# Altium project YVision Ground.PrjPcb
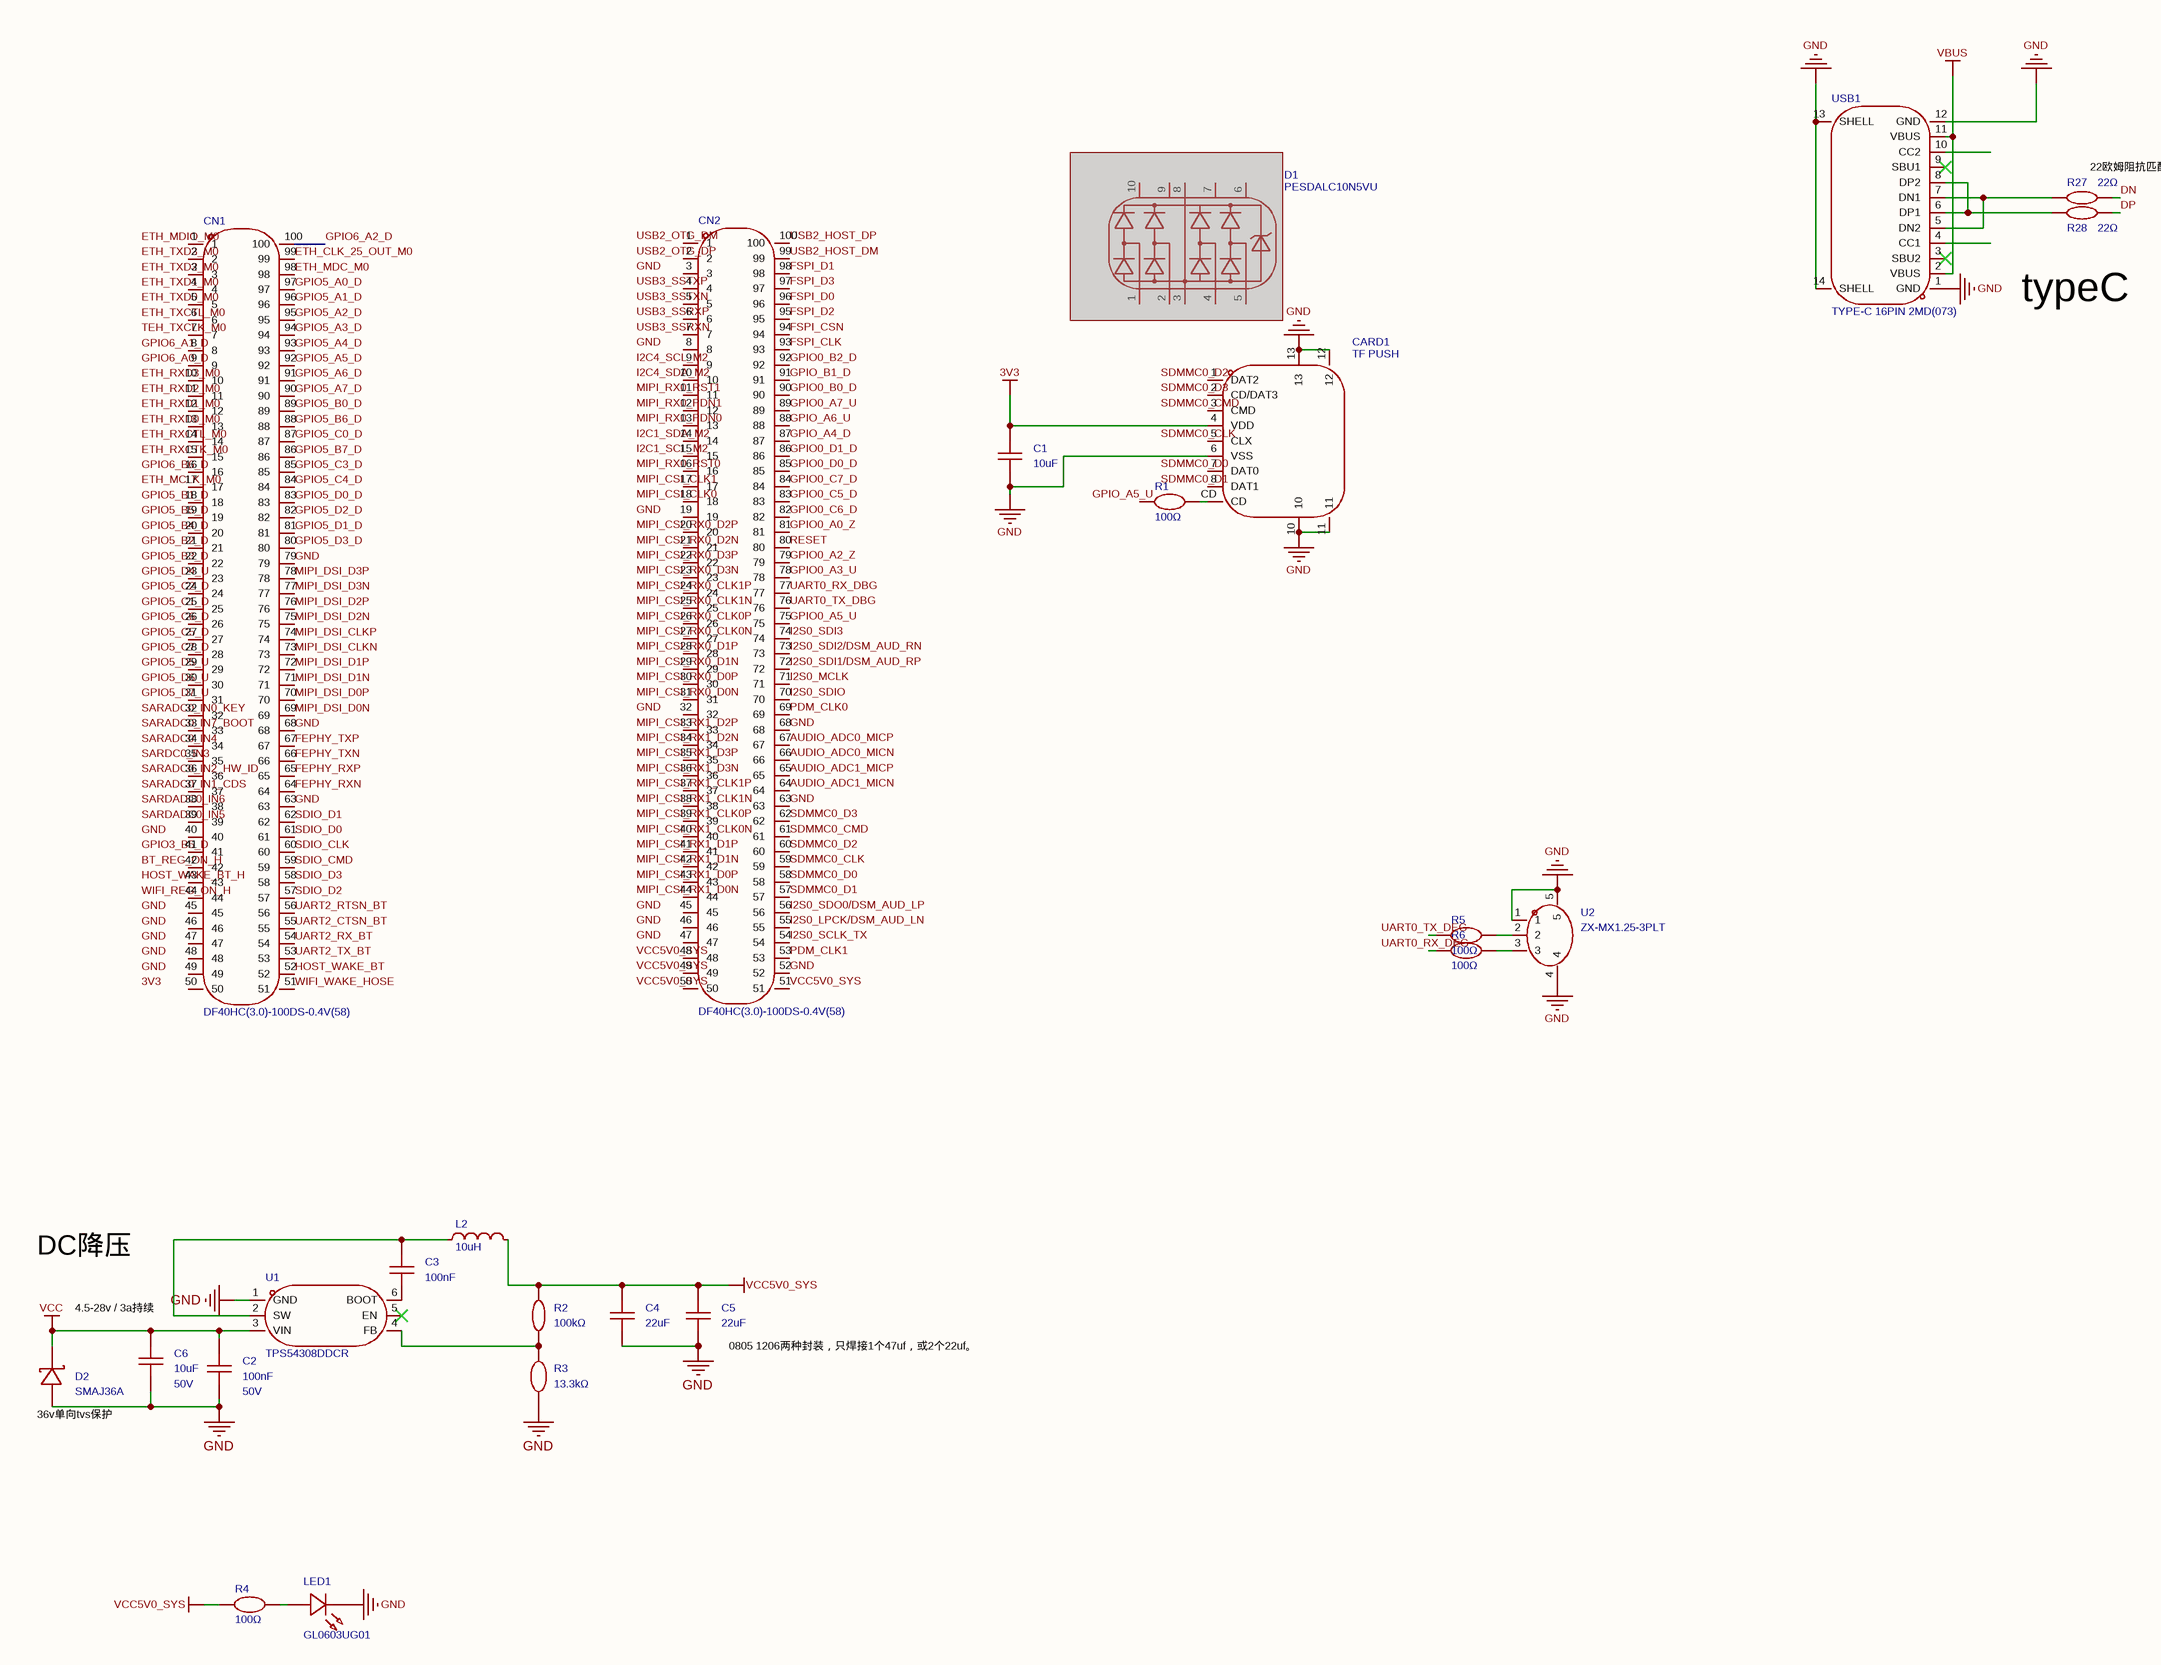
[diagram p0: Schematic1P1.schdoc]
1 sheet, 24 parts. Net scope: global (net labels, ports and power ports of the same name join across sheets).
Board file: PCB.PcbDoc

## Sheet Schematic1P1.schdoc
size 420 x 297 mm; Symbol: Drawing-Symbol_A4; Company: 嘉立创EDA; Version: V1.0; Page Size: A4; @Project Name: YVision_AIR; @Update Date: 2026-09-13; @Create Date: 2026-09-13; Device: Drawing-Symbol_A4; @Board Name: Board1; @Page Name: P1; @Create Time: 01:14:27; @Page Count: 1; @Page No: 1; @Schematic Name: Schematic1; @Update Time: 01:14:27; @Assembly Variant: Basic; Border: 1; Title Block Position: 3; Size: A4; Width: 1655; Height: 1170; Region Start: 1; X Region Count: 6; Y Region Count: 4; Blade Width: 10; SheetNumber: 1; SheetTotal: 1

### Parts
C1  10uF  [C0603]
C2  100nF  Voltage Rated: 50V  [C0603_S]
C3  100nF  [C0603_S]
C4  22uF  [C0805]
C5  22uF  [C0805]
C6  10uF  Voltage Rated: 50V  [C0805_S]
CARD1  TF PUSH  [TF-SMD_TF-PUSH]
CN1  DF40HC(3.0)-100DS-0.4V(58)  [CONN-SMD_DF40HC-3.0-100DS-0.4V-51]
CN2  DF40HC(3.0)-100DS-0.4V(58)  [CONN-SMD_DF40HC-3.0-100DS-0.4V-51]
D1  PESDALC10N5VU  [DFN2510-10_L2.5-W1.0-P0.50-BL]  (masked out: inside a compile mask, not in the netlist)
D2  SMAJ36A  [SMA_L4.3-W2.6-LS5.2-RD]
L2  10uH  [IND-SMD_L4.0-W4.0]
LED1  GL0603UG01  [LED0603-RD]
R1  100Ω  [R0603]
R2  100kΩ  [R0603_S]
R3  13.3kΩ  [R0603_S]
R4  100Ω  [R0402]
R5  100Ω  [R0603]
R6  100Ω  [R0603]
R27  22Ω  [R0603]
R28  22Ω  [R0603]
U1  TPS54308DDCR  [SOT-23-6_L2.9-W1.6-P0.95-LS2.8-BR]
U2  ZX-MX1.25-3PLT  [CONN-SMD_3P-P1.25_MEGASTAR_ZX-MX1.25-3PLT]
USB1  TYPE-C 16PIN 2MD(073)  [USB-C-SMD_TYPE-C-6PIN-2MD-073]

### Nets
3V3: C1.2 CARD1.4(VDD)
GND: C1.1 C2.1 C4.1 C5.1 C6.1 CARD1.6(VSS) CARD1.10 CARD1.11 CARD1.12 CARD1.13 CN1.63 CN1.68 CN1.79 CN2.52 CN2.63 CN2.68 D2.2(A) LED1.1(K) R3.1 U1.1(GND) U2.1 U2.4 U2.5 USB1.1(GND) USB1.12(GND) USB1.13(SHELL) USB1.14(SHELL)
VBUS: USB1.2(VBUS) USB1.11(VBUS)
VCC: C2.2 C6.2 D2.1(K) U1.3(VIN)
VCC5V0_SYS: C4.2 C5.2 CN2.51 L2.2 R2.2 R4.1
AUDIO_ADC0_MICN: CN2.66
AUDIO_ADC0_MICP: CN2.67
AUDIO_ADC1_MICN: CN2.64
AUDIO_ADC1_MICP: CN2.65
DN: R27.2
DP: R28.2
ETH_CLK_25_OUT_M0: CN1.99
ETH_MDC_M0: CN1.98
FEPHY_RXN: CN1.64
FEPHY_RXP: CN1.65
FEPHY_TXN: CN1.66
FEPHY_TXP: CN1.67
FSPI_CLK: CN2.93
FSPI_CSN: CN2.94
FSPI_D0: CN2.96
FSPI_D1: CN2.98
FSPI_D2: CN2.95
FSPI_D3: CN2.97
GPIO0_A0_Z: CN2.81
GPIO0_A2_Z: CN2.79
GPIO0_A3_U: CN2.78
GPIO0_A5_U: CN2.75
GPIO0_A7_U: CN2.89
GPIO0_B0_D: CN2.90
GPIO0_B2_D: CN2.92
GPIO0_C5_D: CN2.83
GPIO0_C6_D: CN2.82
GPIO0_C7_D: CN2.84
GPIO0_D0_D: CN2.85
GPIO0_D1_D: CN2.86
GPIO5_A0_D: CN1.97
GPIO5_A1_D: CN1.96
GPIO5_A2_D: CN1.95
GPIO5_A3_D: CN1.94
GPIO5_A4_D: CN1.93
GPIO5_A5_D: CN1.92
GPIO5_A6_D: CN1.91
GPIO5_A7_D: CN1.90
GPIO5_B0_D: CN1.89
GPIO5_B6_D: CN1.88
GPIO5_B7_D: CN1.86
GPIO5_C0_D: CN1.87
GPIO5_C3_D: CN1.85
GPIO5_C4_D: CN1.84
GPIO5_D0_D: CN1.83
GPIO5_D1_D: CN1.81
GPIO5_D2_D: CN1.82
GPIO5_D3_D: CN1.80
GPIO6_A2_D: CN1.100
GPIO_A4_D: CN2.87
GPIO_A6_U: CN2.88
GPIO_B1_D: CN2.91
HOST_WAKE_BT: CN1.52
I2S0_LPCK/DSM_AUD_LN: CN2.55
I2S0_MCLK: CN2.71
I2S0_SCLK_TX: CN2.54
I2S0_SDI1/DSM_AUD_RP: CN2.72
I2S0_SDI2/DSM_AUD_RN: CN2.73
I2S0_SDI3: CN2.74
I2S0_SDIO: CN2.70
I2S0_SDO0/DSM_AUD_LP: CN2.56
MIPI_DSI_CLKN: CN1.73
MIPI_DSI_CLKP: CN1.74
MIPI_DSI_D0N: CN1.69
MIPI_DSI_D0P: CN1.70
MIPI_DSI_D1N: CN1.71
MIPI_DSI_D1P: CN1.72
MIPI_DSI_D2N: CN1.75
MIPI_DSI_D2P: CN1.76
MIPI_DSI_D3N: CN1.77
MIPI_DSI_D3P: CN1.78
PDM_CLK0: CN2.69
PDM_CLK1: CN2.53
RESET: CN2.80
SDIO_CLK: CN1.60
SDIO_CMD: CN1.59
SDIO_D0: CN1.61
SDIO_D1: CN1.62
SDIO_D2: CN1.57
SDIO_D3: CN1.58
SDMMC0_CLK: CN2.59
SDMMC0_CMD: CN2.61
SDMMC0_D0: CN2.58
SDMMC0_D1: CN2.57
SDMMC0_D2: CN2.60
SDMMC0_D3: CN2.62
UART0_RX_DBG: CN2.77
UART0_TX_DBG: CN2.76
UART2_CTSN_BT: CN1.55
UART2_RTSN_BT: CN1.56
UART2_RX_BT: CN1.54
UART2_TX_BT: CN1.53
USB2_HOST_DM: CN2.99
USB2_HOST_DP: CN2.100
WIFI_WAKE_HOSE: CN1.51
NetC3_1: C3.1 U1.6(BOOT)
NetC3_2: C3.2 L2.1 U1.2(SW)
NetCARD1_CD: CARD1.CD R1.2
NetLED1_2: LED1.2(A) R4.2
NetR2_1: R2.1 R3.2 U1.4(FB)
NetR5_2: R5.2 U2.2
NetR6_2: R6.2 U2.3
NetR27_1: R27.1 USB1.5(DN2) USB1.7(DN1)
NetR28_1: R28.1 USB1.6(DP1) USB1.8(DP2)

Not connected (* = marked no-connect by the designer): CARD1 1(DAT2) 2(CD/DAT3) 3(CMD) 5(CLX) 7(DAT0) 8(DAT1); CN1 1 2 3 4 5 6 7 8 9 10 11 12 13 14 15 16 17 18 19 20 21 22 23 24 25 26 27 28 29 30 31 32 33 34 35 36 37 38 39 40 41 42 43 44 45 46 47 48 49 50; CN2 1 2 3 4 5 6 7 8 9 10 11 12 13 14 15 16 17 18 19 20 21 22 23 24 25 26 27 28 29 30 31 32 33 34 35 36 37 38 39 40 41 42 43 44 45 46 47 48 49 50; R1 1; R5 1; R6 1; U1 5(EN)*; USB1 3(SBU2)* 4(CC1) 9(SBU1)* 10(CC2)

### Notes on the sheet
- 22欧姆阻抗匹配
- typeC
- DC降压
- (near C6) 4.5-28v / 3a持续
- (near C5) 0805 1206两种封装，只焊接1个47uf，或2个22uf。
- (near D2) 36v单向tvs保护
- Labels drawn without touching a wire or pin: 3V3, BT_REG_ON_H, ETH_MCLK_M0, ETH_MDIO_M0, ETH_RXCTK_M0, ETH_RXCTL_M0, ETH_RXD0_M0, ETH_RXD1_M0, ETH_RXD2_M0, ETH_RXD3_M0, ETH_TXCTL_M0, ETH_TXD0_M0, ETH_TXD1_M0, ETH_TXD2_M0, ETH_TXD3_M0, GND, GPIO3_B5_D, GPIO5_B1_D, GPIO5_B2_D, GPIO5_B3_D, GPIO5_B4_D, GPIO5_B5_D, GPIO5_C1_D, GPIO5_C2_D, GPIO5_C5_D, GPIO5_C6_D, GPIO5_C7_D, GPIO5_D4_U, GPIO5_D5_U, GPIO5_D6_U, GPIO5_D7_U, GPIO6_A0_D, GPIO6_A1_D, GPIO6_B6_D, GPIO_A5_U, HOST_WAKE_BT_H, I2C1_SCL_M2, I2C1_SDA_M2, I2C4_SCL_M2, I2C4_SDA_M2, MIPI_CSI_CLK0, MIPI_CSI_CLK1, MIPI_CSI_RX0_CLK0N, MIPI_CSI_RX0_CLK0P, MIPI_CSI_RX0_CLK1N, MIPI_CSI_RX0_CLK1P, MIPI_CSI_RX0_D0N, MIPI_CSI_RX0_D0P, MIPI_CSI_RX0_D1N, MIPI_CSI_RX0_D1P, MIPI_CSI_RX0_D2N, MIPI_CSI_RX0_D2P, MIPI_CSI_RX0_D3N, MIPI_CSI_RX0_D3P, MIPI_CSI_RX1_CLK0N, MIPI_CSI_RX1_CLK0P, MIPI_CSI_RX1_CLK1N, MIPI_CSI_RX1_CLK1P, MIPI_CSI_RX1_D0N, MIPI_CSI_RX1_D0P, MIPI_CSI_RX1_D1N, MIPI_CSI_RX1_D1P, MIPI_CSI_RX1_D2N, MIPI_CSI_RX1_D2P, MIPI_CSI_RX1_D3N, MIPI_CSI_RX1_D3P, MIPI_RX0_PDN0, MIPI_RX0_PDN1, MIPI_RX0_RST0, MIPI_RX0_RST1, SARADC0_IN0_KEY, SARADC0_IN1_CDS, SARADC0_IN2_HW_ID, SARADC0_IN4, SARADC0_IN7_BOOT, SARDADC0_IN5, SARDADC0_IN6, SARDC0_IN3, SDMMC0_CLK, SDMMC0_CMD, SDMMC0_D0, SDMMC0_D1, SDMMC0_D2, SDMMC0_D3, TEH_TXCLK_M0, UART0_RX_DEG, UART0_TX_DEG, USB2_OTG_DM, USB2_OTG_DP, USB3_SSRXN, USB3_SSRXP, USB3_SSTXN, USB3_SSTXP, VCC5V0_SYS, WIFI_REG_ON_H

### Library data of the parts
C1 = FCC0603X106K100CT: 容值:10uF;精度:±10%;额定电压:10V;温度系数:X5R;; Manufacturer: FOJAN(富捷); AddInBom: yes; ModelId: ac125912035d415993ca9572d50418b1聨0819f05c4eef4c71ace90d822a990e87; ModelName: C0603_L1.6-W0.8-H0.8; ModelTransform: 62.992,31.496,0,0,0,0,0,0,0; Tolerance: ±10%; Voltage Rating: 10V; Temperature Coefficient: X5R; Symbol: FCC0603X106K100CT; Device: FCC0603X106K100CT; LCSC Part Name: 10uF ±10% 10V; SupplierPart: C5137565; ManufacturerPart: FCC0603X106K100CT; Supplier Footprint: 0603; JLCPCB Part Class: Extended Part; Datasheet: https://item.szlcsc.com/datasheet/FCC0603X106K100CT/5747017.html; Supplier: LCSC; ConvertToPcb: yes; FootprintName: C0603; Value: 10uF; Operating Temperature: -55℃~+85℃
C2 = CC0603KRX7R9BB104: 容值:100nF;精度:±10%;额定电压:50V;材质(温度系数):X7R;; Manufacturer: YAGEO(国巨); Convert to PCB: yes; 3D Model: ac125912035d415993ca9572d50418b1; 3D Model Transform: 62.992,31.496,0,0,0,0,0,0,0; Tolerance: ±10%; Temperature Coefficient: X7R; ModelName: C0603_L1.6-W0.8-H0.8; Symbol: CC0603KRX7R9BB104; Device: CC0603KRX7R9BB104; LCSC Part Name: 100nF ±10% 50V; Supplier Footprint: 0603; Datasheet: https://atta.szlcsc.com/upload/public/pdf/source/20180910/C282072_33301C7F631E79921B82A8DAC6BCC5B3.pdf; Supplier: LCSC; Manufacturer Part: CC0603KRX7R9BB104; Value: 100nF; Supplier Part: C14663; JLCPCB Part Class: 基础库; AddInBom: yes; FootprintName: C0603_S
C3 = CC0603KRX7R9BB104: 容值:100nF;精度:±10%;额定电压:50V;材质(温度系数):X7R;; Manufacturer: YAGEO(国巨); 3D Model: ac125912035d415993ca9572d50418b1; 3D Model Transform: 62.992,31.496,0,0,0,0,0,0,0; Tolerance: ±10%; Voltage Rated: 50V; Temperature Coefficient: X7R; AddInBom: yes; ModelName: C0603_L1.6-W0.8-H0.8; Symbol: CC0603KRX7R9BB104; Device: CC0603KRX7R9BB104; LCSC Part Name: 100nF ±10% 50V; Supplier Footprint: 0603; Datasheet: https://atta.szlcsc.com/upload/public/pdf/source/20180910/C282072_33301C7F631E79921B82A8DAC6BCC5B3.pdf; Supplier: LCSC; Manufacturer Part: CC0603KRX7R9BB104; Value: 100nF; Supplier Part: C14663; JLCPCB Part Class: 基础库; ConvertToPcb: yes; FootprintName: C0603_S
C4 C5 = HGC0805R5226M350NSLJ: 容值:22uF;精度:±20%;额定电压:35V;温度系数:X5R;; Manufacturer: Chinocera(华瓷); 3D Model: 1ba041120af144c991958decab20d241聨0819f05c4eef4c71ace90d822a990e87; 3D Model Transform: 78.74,51.181,0,0,0,0,0,0.0005,0; Tolerance: ±20%; Voltage Rating: 35V; Temperature Coefficient: X5R; AddInBom: yes; ModelName: C0805_L2.0-W1.3-H1.3; Symbol: HGC0805R5226M350NSLJ; Device: HGC0805R5226M350NSLJ; LCSC Part Name: 22uF ±20% 35V; Supplier Part: C22367832; Manufacturer Part: HGC0805R5226M350NSLJ; Supplier Footprint: 0805; JLCPCB Part Class: Extended Part; Datasheet: https://item.szlcsc.com/datasheet/HGC0805R5226M350NSLJ/23841137.html; Supplier: LCSC; Value: 22uF; ConvertToPcb: yes; FootprintName: C0805
C6 = GRM21BR61H106KE43L: 容值:10uF;精度:±10%;额定电压:50V;材质(温度系数):X5R;; Manufacturer: muRata(村田); 3D Model: 1ba041120af144c991958decab20d241; 3D Model Transform: 78.74,51.181,0,0,0,0,0,0.0005,0; Tolerance: ±10%; Temperature Coefficient: X5R; AddInBom: yes; ModelName: C0805_L2.0-W1.3-H1.3; Symbol: GRM21BR61H106KE43L; Device: GRM21BR61H106KE43L; LCSC Part Name: 10uF ±10% 50V; Supplier Footprint: 0805; Datasheet: https://atta.szlcsc.com/upload/public/pdf/source/20230811/95AAE0C9AF55EDC31B7A4D8B733F534E.pdf; Supplier: LCSC; Supplier Part: C440198; Manufacturer Part: GRM21BR61H106KE43L; Value: 10uF; JLCPCB Part Class: 基础库; ConvertToPcb: yes; FootprintName: C0805_S
CARD1 = TF PUSH: 卡连接方式:自弹式;卡类型:MicroSD卡(TF卡);连接器类型:卡座;本体最大高度:2mm;工作温度:-25℃~+85℃;; Manufacturer: SHOU HAN(首韩); AddInBom: yes; ModelId: 2d6270e77c9a43c6bb0aca962ba811a2聨0819f05c4eef4c71ace90d822a990e87; ModelTransform: 635.826,598.424,0,0,0,0,0.002,-82.441,-23.622; Card Connection Mode: 自弹式; Connector Type: 卡座; Additional Card Detection Pins: 有; Symbol: TF PUSH; Device: TF PUSH; LCSC Part Name: 自弹式 MicroSD卡(TF卡) 卡座; SupplierPart: C393941; ManufacturerPart: TF PUSH; Supplier Footprint: SMD; JLCPCB Part Class: Extended Part; Datasheet: https://item.szlcsc.com/datasheet/TF%2520PUSH/372553.html; Supplier: LCSC; ConvertToPcb: yes; FootprintName: TF-SMD_TF-PUSH; ModelName: TF-SMD_TF-PUSH; Card Type: MicroSD卡(TF卡); Supplementary Features: -; Height Above Board: 2mm; Operating Temperature: -25℃~+85℃; Rated Voltage (Max): -; Length: 14.75mm; Width: 14.5mm
CN1 = DF40HC(3.0)-100DS-0.4V(58): 3D Model: 6a7bb5672138401ca803df45e026c3f5聨0819f05c4eef4c71ace90d822a990e87; 3D Model Transform: 889.762,133.0706,0,0,0,0,0,0,0; AddInBom: yes; Symbol: DF40HC(3.0)-100DS-0.4V(58); Device: DF40HC(3.0)-100DS-0.4V(58); LCSC Part Name: DF40HC(3.0)-100DS-0.4V(58); Supplier Part: C9900007647; Manufacturer Part: DF40HC(3.0)-100DS-0.4V(58); Supplier Footprint: CONN-SMD; JLCPCB Part Class: Extended Part; Supplier: LCSC; ConvertToPcb: yes; FootprintName: CONN-SMD_DF40HC-3.0-100DS-0.4V-51; ModelName: CONN-SMD_DF40HC-3.0-100DS-0.4V-51
CN2 = DF40HC(3.0)-100DS-0.4V(58): AddInBom: yes; ModelId: 6a7bb5672138401ca803df45e026c3f5聨0819f05c4eef4c71ace90d822a990e87; ModelTransform: 889.762,133.0706,0,0,0,0,0,0,0; Symbol: DF40HC(3.0)-100DS-0.4V(58); Device: DF40HC(3.0)-100DS-0.4V(58); LCSC Part Name: DF40HC(3.0)-100DS-0.4V(58); SupplierPart: C9900007647; ManufacturerPart: DF40HC(3.0)-100DS-0.4V(58); Supplier Footprint: CONN-SMD; JLCPCB Part Class: Extended Part; Supplier: LCSC; ConvertToPcb: yes; FootprintName: CONN-SMD_DF40HC-3.0-100DS-0.4V-51; ModelName: CONN-SMD_DF40HC-3.0-100DS-0.4V-51
D1 = PESDALC10N5VU_C41348084: 极性:单向;反向截止电压(Vrwm):5V;钳位电压:16V;峰值脉冲电流(Ipp):4A@8/20us;峰值脉冲功率(Ppp):80W@8/20us;击穿电压(VBR):9.5V;; Manufacturer: TECH PUBLIC(台舟); Convert to PCB: no; AddInBom: yes; ModelId: 55525fa8fc914f7c8ffcb10749ea5f73聨0819f05c4eef4c71ace90d822a990e87; ModelName: DFN-10_L2.5-W1.0-H0.5-P0.50; ModelTransform: 40.1574,98.425,0,90,0,0,0,0,0; Polarity: 单向; Reverse Stand-Off Voltage (Vrwm): 5V; Clamping Voltage: 16V; Voltage - Breakdown: 9.5V; Reverse Leakage Current (Ir): 100nA; Number of Channels: 四路; level of protection: IEC 61000-4-4；IEC 61000-4-5；IEC 61000-4-2; Type: TVS; Junction Capacitance: 0.8pF；0.3pF; Symbol: PESDALC10N5VU_C41348084; Device: PESDALC10N5VU_C41348084; LCSC Part Name: 单向TVS 5V截止 峰值浪涌电流：4A@8/20us; SupplierPart: C41348084; ManufacturerPart: PESDALC10N5VU; Supplier Footprint: DFN2510-10; JLCPCB Part Class: Extended Part; Datasheet: https://item.szlcsc.com/datasheet/PESDALC10N5VU/43078153.html; Supplier: LCSC; FootprintName: DFN2510-10_L2.5-W1.0-P0.50-BL; Peak Pulse Current (Ipp): 4A@8/20us; Peak Pulse Power Dissipation (Ppp): 80W@8/20us; Operating Temperature: -55℃~+125℃
D2 = SMAJ36A_C148232: 极性:单向;反向截止电压(Vrwm):36V;钳位电压:58.1V;峰值脉冲电流(Ipp):6.9A;峰值脉冲功率(Ppp):400W@10/1000us;击穿电压:44.2V;; Manufacturer: Littelfuse(美国力特); 3D Model: e3551acb3c5a4975a5e9d36087fe1fa2聨0819f05c4eef4c71ace90d822a990e87; 3D Model Transform: 185.039,102.362,0,0,0,0,0,0,0; Polarity: 单向; Reverse Stand-Off Voltage (Vrwm): 36V; Clamping Voltage: 58.1V; Peak Pulse Current (Ipp): 6.9A; Voltage - Breakdown: 44.2V; Reverse Leakage Current (Ir): 6.9uA; level of protection: IEC 61000-4-4；IEC 61000-4-2; Type: TVS; AddInBom: yes; Symbol: SMAJ36A_C148232; Device: SMAJ36A_C148232; LCSC Part Name: TVS 36V截止 6.9A峰值脉冲; Supplier Part: C148232; Manufacturer Part: SMAJ36A; Supplier Footprint: DO-214AC(SMA); JLCPCB Part Class: Extended Part; Datasheet: https://item.szlcsc.com/datasheet/SMAJ36A/159565.html; Supplier: LCSC; Peak Pulse Power Dissipation (Ppp): 400W@10/1000us; Operating Temperature: -65℃~+150℃; ConvertToPcb: yes; FootprintName: SMA_L4.3-W2.6-LS5.2-RD; ModelName: SMA_L4.3-W2.6-LS5.2-RD
L2 = FHD4020S-100MT: 电感值:10uH;精度:±20%;额定电流:2.35A;饱和电流(Isat):3.5A;类型:-;; Manufacturer: cjiang(长江微电); 3D Model: 45bc3737ecfd4f3bb122605ee525b018聨0819f05c4eef4c71ace90d822a990e87; 3D Model Transform: 157.48,157.484,0,0,0,0,0,0,0; Tolerance: ±20%; Current Rating: 2.35A; Current - Saturation(Isat): 3.5A; DC Resistance(DCR): 190mΩ; AddInBom: yes; ModelName: IND-SMD_L4.0-W4.0-H1.9; Symbol: FHD4020S-100MT; Device: FHD4020S-100MT; LCSC Part Name: 10uH ±20% 3.5A; Supplier Part: C602032; Manufacturer Part: FHD4020S-100MT; Supplier Footprint: SMD,4x4mm; JLCPCB Part Class: Extended Part; Datasheet: https://item.szlcsc.com/datasheet/FHD4020S-100MT/631462.html; Supplier: LCSC; Value: 10uH; Type: -; ConvertToPcb: yes; FootprintName: IND-SMD_L4.0-W4.0
LED1 = GL0603UG01: 灯头类型:-;发光颜色:翠绿色;正向压降(Vf):2.7V~3.2V;功率:-;测试电流:20mA;波长:510nm~531nm;二极管配置:独立二极管;透镜颜色:无色透明透镜;色温:-;发光强度:173mcd~350mcd;发光角度:120°;载带方式:正贴;工作温度:-40℃~+85℃;; Manufacturer: Guiguang light(桂光光电); AddInBom: yes; ModelId: 1f0d29a91be547639d425604e9b96ebb聨0819f05c4eef4c71ace90d822a990e87; ModelTransform: 63.7794,32.283,0,0,0,0,0,0,0; Illumination Color: 翠绿色; Test Current: 20mA; Diode Configuration: 独立二极管; Lens Color: 无色透明透镜; Viewing Angle: 120°; Symbol: GL0603UG01; Device: GL0603UG01; LCSC Part Name: 0603 翠绿 高亮; SupplierPart: C51933293; ManufacturerPart: GL0603UG01; Supplier Footprint: 0603; JLCPCB Part Class: Extended Part; Datasheet: https://item.szlcsc.com/datasheet/GL0603UG01/54645989.html; Supplier: LCSC; ConvertToPcb: yes; FootprintName: LED0603-RD; ModelName: LED0603-RD; Lamp Holder Type: -; Voltage - Forward(Vf): 2.7V~3.2V; Power(Watts): -; Wavelength - Dominant: 510nm~531nm; Peak Wavelength: -; Color Temperature: -; Luminous Intensity: 173mcd~350mcd; Mounting Style: 正贴; Operating Temperature: -40℃~+85℃
R1 = FRC0603J101 TS: 电阻类型:厚膜电阻;阻值:100Ω;精度:±5%;功率:100mW;工作电压:75V;温度系数:±100ppm/℃;; Manufacturer: FOJAN(富捷); AddInBom: yes; ModelId: fc143cca1e79419f9cd78b61e9279f08聨0819f05c4eef4c71ace90d822a990e87; ModelTransform: 31.8897,63.7794,0,90,0,0,0,0,0; Tolerance: ±5%; Power(Watts): 100mW; Voltage-Supply(Max): 75V; Symbol: FRC0603J101 TS; Device: FRC0603J101 TS; LCSC Part Name: 100Ω ±5% 100mW 厚膜电阻; SupplierPart: C2907089; ManufacturerPart: FRC0603J101 TS; Supplier Footprint: 0603; JLCPCB Part Class: Extended Part; Datasheet: https://item.szlcsc.com/datasheet/FRC0603J101%2520TS/3180602.html; Supplier: LCSC; ConvertToPcb: yes; FootprintName: R0603; ModelName: R0603; Type: 厚膜电阻; Value: 100Ω; Temperature Coefficient: ±100ppm/℃; Operating Temperature: -55℃~+155℃
R2 = 0603WAF1003T5E: 电阻类型:厚膜电阻;阻值:100kΩ;精度:±1%;功率:100mW;最大工作电压:75V;温度系数:±100ppm/℃;; Manufacturer: UNI-ROYAL(厚声); 3D Model: fc143cca1e79419f9cd78b61e9279f08; 3D Model Transform: 31.8897,63.7794,0,90,0,0,0,0,0; Tolerance: ±1%; Power(Watts): 100mW; Overload Voltage (Max): 75V; AddInBom: yes; ModelName: R0603; Symbol: 0603WAF1003T5E; Device: 0603WAF1003T5E; Supplier Part: C861117; LCSC Part Name: 100kΩ ±1% 100mW 厚膜电阻; Manufacturer Part: 0603WAF1003T5E; Supplier Footprint: 0603; JLCPCB Part Class: 基础库; Datasheet: https://atta.szlcsc.com/upload/public/pdf/source/20200306/C422600_1E6D84923E4A46A82E41ADD87F860B5C.pdf; Supplier: LCSC; Type: 厚膜电阻; Value: 100kΩ; Temperature Coefficient: ±100ppm/℃; Operating Temperature Range: -55℃~+155℃; ConvertToPcb: yes; FootprintName: R0603_S
R3 = RT0603BRD0713K3L: 电阻类型:薄膜电阻;阻值:13.3kΩ;精度:±0.1%;功率:100mW;最大工作电压:75V;温度系数:±25ppm/℃;; Manufacturer: YAGEO(国巨); 3D Model: fc143cca1e79419f9cd78b61e9279f08; 3D Model Transform: 31.8897,63.7794,0,90,0,0,0,0,0; Tolerance: ±0.1%; Power(Watts): 100mW; Overload Voltage (Max): 75V; AddInBom: yes; ModelName: R0603; Symbol: RT0603BRD0713K3L; Device: RT0603BRD0713K3L; LCSC Part Name: 薄膜电阻 13.3kΩ ±0.1% 100mW; Supplier Part: C861117; Manufacturer Part: RT0603BRD0713K3L; Supplier Footprint: 0603; JLCPCB Part Class: 扩展库; Datasheet: https://atta.szlcsc.com/upload/public/pdf/source/20200610/C326738_5639A9F1B6EB6E4AE2197577D3456E7F.pdf; Supplier: LCSC; Type: 薄膜电阻; Value: 13.3kΩ; Temperature Coefficient: ±25ppm/℃; Operating Temperature Range: -55℃~+155℃; ConvertToPcb: yes; FootprintName: R0603_S
R4 = FRC0402F1000TS: 电阻类型:厚膜电阻;阻值:100Ω;精度:±1%;功率:62.5mW;工作电压:50V;温度系数:±100ppm/℃;; Manufacturer: FOJAN(富捷); AddInBom: yes; ModelId: 98c88bc2b9094f218f3a3e30a7012738聨0819f05c4eef4c71ace90d822a990e87; ModelName: R0402_L1.0-W0.5-H0.4; ModelTransform: 39.37,19.685,0,0,0,0,0,0,0; Tolerance: ±1%; Power(Watts): 62.5mW; Voltage-Supply(Max): 50V; Symbol: FRC0402F1000TS; Device: FRC0402F1000TS; LCSC Part Name: 100Ω ±1% 62.5mW 厚膜电阻; SupplierPart: C2906860; ManufacturerPart: FRC0402F1000TS; Supplier Footprint: 0402; JLCPCB Part Class: Extended Part; Datasheet: https://item.szlcsc.com/datasheet/FRC0402F1000TS/3180373.html; Supplier: LCSC; ConvertToPcb: yes; FootprintName: R0402; Type: 厚膜电阻; Value: 100Ω; Temperature Coefficient: ±100ppm/℃; Operating Temperature: -55℃~+155℃
R5 R6 = FRC0603F1000TS: 电阻类型:厚膜电阻;阻值:100Ω;精度:±1%;功率:100mW;工作电压:75V;温度系数:±100ppm/℃;; Manufacturer: FOJAN(富捷); 3D Model: fc143cca1e79419f9cd78b61e9279f08聨0819f05c4eef4c71ace90d822a990e87; 3D Model Transform: 31.8897,63.7794,0,90,0,0,0,0,0; Tolerance: ±1%; Power(Watts): 100mW; Voltage-Supply(Max): 75V; AddInBom: yes; Symbol: FRC0603F1000TS; Device: FRC0603F1000TS; LCSC Part Name: 100Ω ±1% 100mW 厚膜电阻; Supplier Part: C2906981; Manufacturer Part: FRC0603F1000TS; Supplier Footprint: 0603; JLCPCB Part Class: Extended Part; Datasheet: https://item.szlcsc.com/datasheet/FRC0603F1000TS/3180494.html; Supplier: LCSC; Type: 厚膜电阻; Value: 100Ω; Temperature Coefficient: ±100ppm/℃; Operating Temperature: -55℃~+155℃; ConvertToPcb: yes; FootprintName: R0603; ModelName: R0603
R27 R28 = 0603WAF220JT5E: 电阻类型:厚膜电阻;阻值:22Ω;精度:±1%;功率:100mW;最大工作电压:75V;温度系数:±100ppm/℃;; Manufacturer: UNI-ROYAL(厚声); 3D Model: fc143cca1e79419f9cd78b61e9279f08聨0819f05c4eef4c71ace90d822a990e87; 3D Model Transform: 31.8897,63.7794,0,90,0,0,0,0,0; Tolerance: ±1%; Power(Watts): 100mW; Overload Voltage (Max): 75V; AddInBom: yes; Symbol: 0603WAF220JT5E; Device: 0603WAF220JT5E; LCSC Part Name: 22Ω ±1% 100mW 厚膜电阻; Supplier Part: C23345; Manufacturer Part: 0603WAF220JT5E; Supplier Footprint: 0603; JLCPCB Part Class: Basic Part; Datasheet: https://atta.szlcsc.com/upload/public/pdf/source/20200306/C422600_1E6D84923E4A46A82E41ADD87F860B5C.pdf; Supplier: LCSC; Type: 厚膜电阻; Value: 22Ω; Temperature Coefficient: ±100ppm/℃; Operating Temperature Range: -55℃~+155℃; ConvertToPcb: yes; FootprintName: R0603; ModelName: R0603
U1 = TPS54308DDCR: 功能类型:降压型;输出类型:可调;输入电压:4.5V~28V;输出电压:1V~26V;输出电流(最大值):3A;; Manufacturer: TI(德州仪器); Symbol: TPS54302DDCR_C311983; 3D Model: 18da8f6c14a34920b3e136b5c401a119; 3D Model Transform: 110.73671,114.173,0,180,0,0,0.001,-0.003,0; Function: 降压型; Output Type: 可调; Output Voltage: 1V~26V; Output Current (Max): 3A; Switching Frequency: 350kHz; Synchronous Rectification: 是; Number of Outputs: 1; Topology: 降压式; Switch tube (built-in/external): 内置; Quiescent Current (Iq): 300uA; AddInBom: yes; ModelName: SOT-23-6_L2.9-W1.6-H1.5-LS2.8-P0.95; Device: TPS54308DDCR; LCSC Part Name: TPS54308DDCR; Supplier Part: C168839; Manufacturer Part: TPS54308DDCR; Supplier Footprint: SOT-23-6; JLCPCB Part Class: Extended Part; Datasheet: https://www.ti.com/cn/lit/gpn/tps54308; Supplier: LCSC; Input Voltage: 4.5V~28V; Operating Temperature: -40℃~+125℃@(TJ); Output Current: 3A; ConvertToPcb: yes; FootprintName: SOT-23-6_L2.9-W1.6-P0.95-LS2.8-BR
U2 = ZX-MX1.25-3PLT: 插针结构:1x3P;间距:1.25mm;安装方式:立贴;参考系列:PicoBlade(MX 1.25);总PIN数:3P;排数:1;每排PIN数:3;行距:-;额定电流:1A;触头材质:黄铜;触头镀层:锡;工作温度:-25℃~+85℃;; Manufacturer: Megastar(兆星); AddInBom: yes; ModelId: 1238d5770fa9449482223f3dcff75b33聨0819f05c4eef4c71ace90d822a990e87; ModelTransform: 344.881,173.6217,0,0,0,0,0.003,-4.919,0; Pins Structure: 1x3P; Pitch: 1.25mm; Number of PINs Per Row: 3; Current Rating: 1A; Voltage Rating: 125V; Plastic Material: LCP; Supplementary Features: 辅助焊脚; Z-Height of the Board: 4.7mm; X-Length of Bottom Edge on Board (Spacing Line): 8.75mm; Y-Width of Bottom Edge on Board: 4.3mm; Symbol: ZX-MX1.25-3PLT; Device: ZX-MX1.25-3PLT; LCSC Part Name: 1x3P 间距:1.25mm 立贴 系列:PicoBlade(MX 1.25); SupplierPart: C7430474; ManufacturerPart: ZX-MX1.25-3PLT; Supplier Footprint: SMD,P=1.25mm; JLCPCB Part Class: Extended Part; Datasheet: https://item.szlcsc.com/datasheet/ZX-MX1.25-3PLT/8430343.html; Supplier: LCSC; ConvertToPcb: yes; FootprintName: CONN-SMD_3P-P1.25_MEGASTAR_ZX-MX1.25-3PLT; ModelName: CONN-SMD_3P-P1.25_MEGASTAR_ZX-MX1.25-3PLT; Mounting Type: 立贴; Reference Series: PicoBlade(MX 1.25); Number of Pins: 3P; Number of Rows: 1; Row Spacing: -; Contact Material: 黄铜; Contact Plating: 锡; Operating Temperature: -25℃~+85℃; Flame Retardant Rating: -; Color: 米色
USB1 = TYPE-C 16PIN 2MD(073): 连接器类型:Type-C;协议标准:-;公母:母;安装方式:卧贴;触点数量:16P;端口数量:1;额定电流 - 电源:3A;工作温度:-25℃~+85℃;; Manufacturer: SHOU HAN(首韩); 3D Model: 3a41b9ec9b654a0fad4d118405ec6290聨0819f05c4eef4c71ace90d822a990e87; 3D Model Transform: 351.9678,298.4246,0,0,0,0,0,-47.244,-35.433; Gender: 母; Number of Contacts: 16P; Number of Ports: 1; Current Rating-Power: 3A; Voltage Rating: 5V; Connect-Disconnect Life: 5千次; Detection color: 黑色; AddInBom: yes; Symbol: TYPE-C 16PIN 2MD(073); Device: TYPE-C 16PIN 2MD(073); LCSC Part Name: 16P卧贴母座; Supplier Part: C2765186; Manufacturer Part: TYPE-C 16PIN 2MD(073); Supplier Footprint: SMD; JLCPCB Part Class: Extended Part; Datasheet: https://item.szlcsc.com/datasheet/TYPE-C%252016PIN%25202MD(073)/2901843.html; Supplier: LCSC; Connector Type: Type-C; Protocol Standard: -; Mounting Type: 卧贴; Supplementary Features: -; Center Height: -; Length: -; Operating Temperature: -25℃~+85℃; ConvertToPcb: yes; FootprintName: USB-C-SMD_TYPE-C-6PIN-2MD-073; ModelName: USB-C-SMD_TYPE-C-6PIN-2MD-073